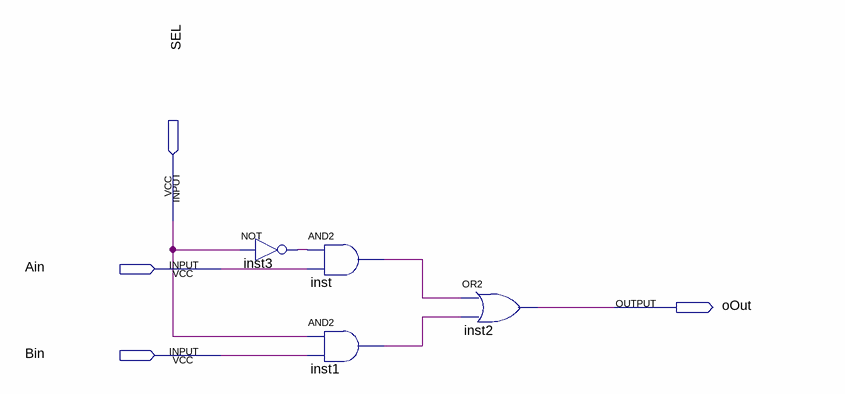
[diagram p0: schematic sheet]
// Quartus schematic mux2x1_1bit.bdf as structural Verilog: 4 symbols, 4 pins
module mux2x1_1bit (
  input  SEL,
  input  Ain,
  input  Bin,
  output oOut
);

  wire inst1_out, inst3_out, inst_out;

  not inst3 (inst3_out, SEL);
  and inst (inst_out, inst3_out, Ain);
  and inst1 (inst1_out, SEL, Bin);
  or inst2 (oOut, inst_out, inst1_out);
endmodule
